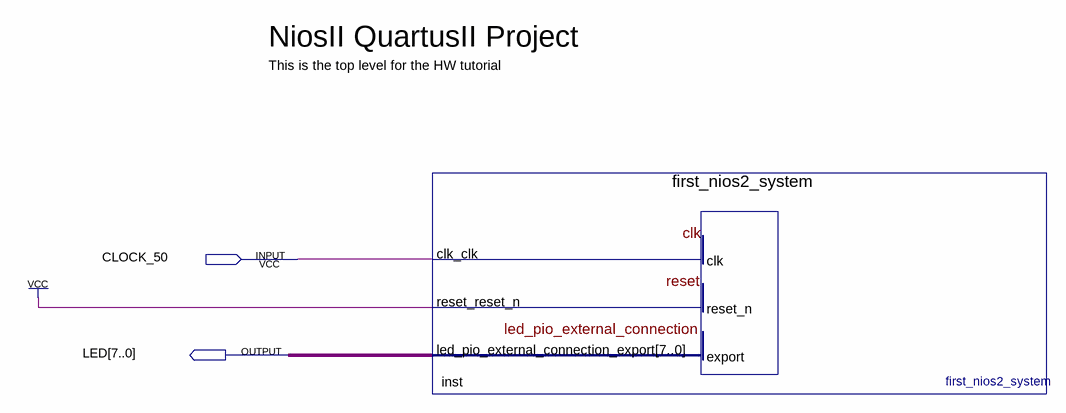
[diagram p0: schematic sheet]
// Quartus schematic nios2_quartus2_project.bdf as structural Verilog: 1 symbols, 2 pins
module nios2_quartus2_project (
  input  CLOCK_50,
  output [7:0] LED
);

  first_nios2_system inst (.clk_clk(CLOCK_50), .reset_reset_n(1'b1), .led_pio_external_connection_export(LED));

  // Notes on the sheet:
  //   NiosII QuartusII Project
  //   This is the top level for the HW tutorial
endmodule
